# EAGLE design WifiAC-controller (EAGLE 7.4.0)
CNAME: Break-out board; CREVISION: V 2.0; DESIGNER: Mosab Wadea
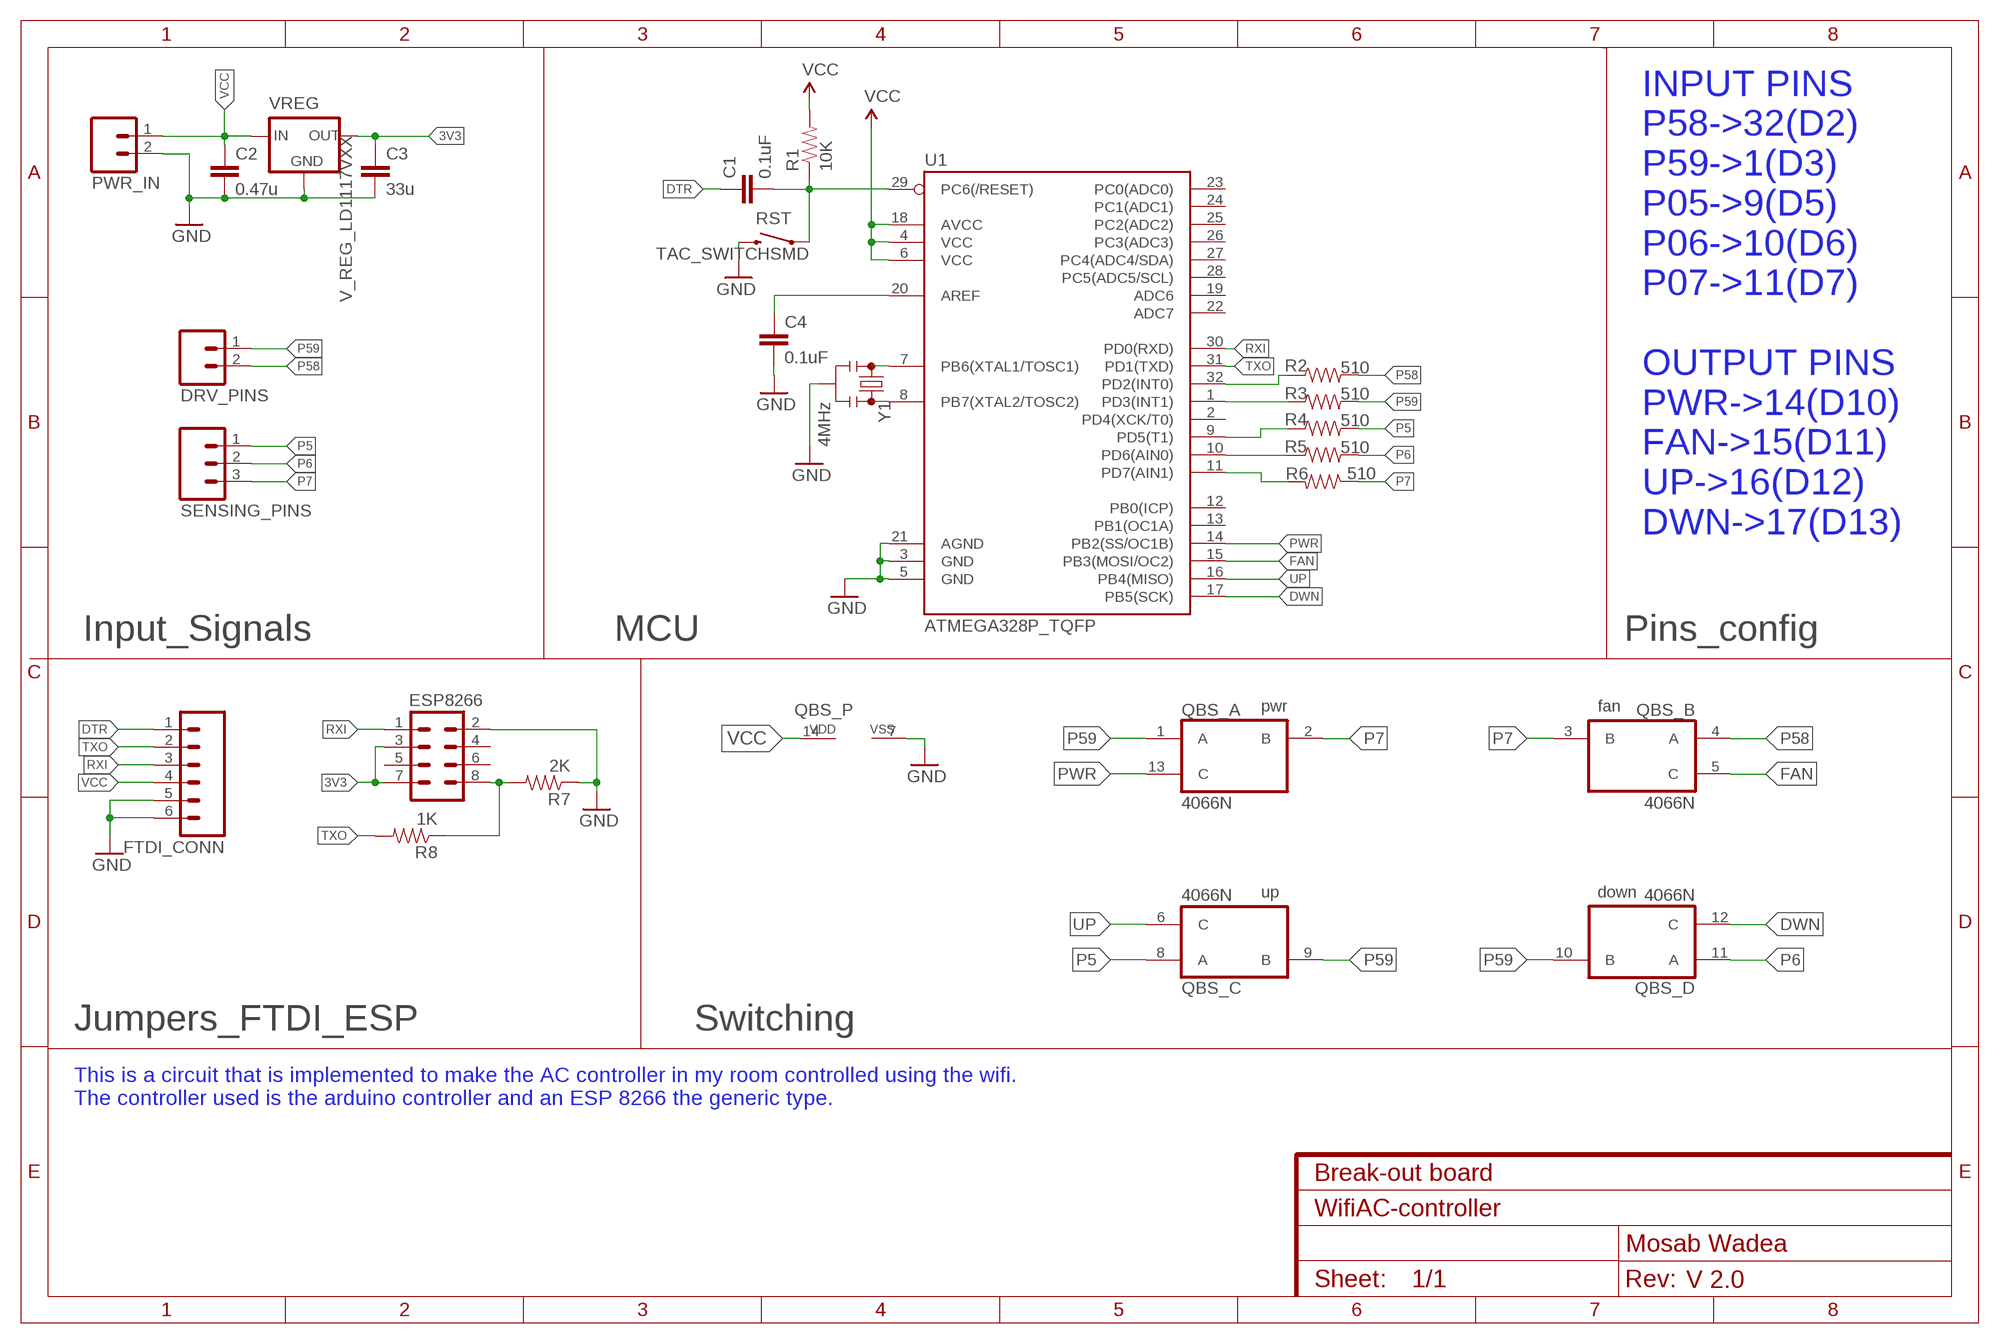
[diagram p0: schematic, sheet 1]

## Parts
C1  0.1uF  CAP0805  [0805]
C2  0.47u  CAP0805  [0805]
C3  33u  CAP0805  [0805]
C4  0.1uF  CAP0805  [0805]
DRV_PINS  M02POLAR  [MOLEX-1X2]
ESP8266  M04X2  [2X4]
FTDI_CONN  M06NO_SILK_FEMALE_PTH  [1X06_NO_SILK]
PWR_IN  M02POLAR  [MOLEX-1X2]
QBS_  4066N  [DIL14]
R1  10K  RESISTOR0805-RES  [0805]
R2  510  RESISTOR0805-RES  [0805]
R3  510  RESISTOR0805-RES  [0805]
R4  510  RESISTOR0805-RES  [0805]
R5  510  RESISTOR0805-RES  [0805]
R6  510  RESISTOR0805-RES  [0805]
R7  2K  RESISTOR0805-RES  [0805]
R8  1K  RESISTOR0805-RES  [0805]
RST  TAC_SWITCHSMD  SWITCH-MOMENTARY-2SMD-REDUNDANT  [TACTILE-SWITCH-SMD]
SENSING_PINS  M03POLAR  [MOLEX-1X3]
U1  ATMEGA328P_TQFP  [TQFP32-08]
VREG  V_REG_LD1117VXX  [78XXL]
Y1  4MHz  RESONATOR4MHZ  [RESONATOR-SMD_MED]

## Nets
3V3: C3.1 ESP8266.3 ESP8266.7 VREG.GND(OUT)
DTR: C1.1 FTDI_CONN.1
DWN: QBS_.12(D:C) U1.17(PB5(SCK))
FAN: QBS_.5(B:C) U1.15(PB3(MOSI/OC2))
GND: C2.2 C3.2 C4.2 ESP8266.2 FTDI_CONN.5 FTDI_CONN.6 PWR_IN.2 QBS_.7(P:VSS) R7.1 RST.3 RST.4 U1.3(GND) U1.5(GND) U1.21(AGND) VREG.IN(GND) Y1.2
N$1: C1.2 R1.1 RST.1 RST.2 U1.29(PC6(/RESET))
N$3: C4.1 U1.20(AREF)
N$4: U1.7(PB6(XTAL1/TOSC1)) Y1.1
N$5: U1.8(PB7(XTAL2/TOSC2)) Y1.3
N$6: R2.1 U1.32(PD2(INT0))
N$7: R3.1 U1.1(PD3(INT1))
N$8: R4.1 U1.9(PD5(T1))
N$9: R5.1 U1.10(PD6(AIN0))
N$10: R6.2 U1.11(PD7(AIN1))
N$14: ESP8266.8 R7.2 R8.1
P5: QBS_.8(C:A) R4.2 SENSING_PINS.1
P6: QBS_.11(D:A) R5.2 SENSING_PINS.2
P7: QBS_.2(A:B) QBS_.3(B:B) R6.1 SENSING_PINS.3
P58: DRV_PINS.2 QBS_.4(B:A) R2.2
P59: DRV_PINS.1 QBS_.1(A:A) QBS_.9(C:B) QBS_.10(D:B) R3.2
PWR: QBS_.13(A:C) U1.14(PB2(SS/OC1B))
RXI: ESP8266.1 FTDI_CONN.3 U1.30(PD0(RXD))
TXO: FTDI_CONN.2 R8.2 U1.31(PD1(TXD))
UP: QBS_.6(C:C) U1.16(PB4(MISO))
VCC: C2.1 FTDI_CONN.4 PWR_IN.1 QBS_.14(P:VDD) R1.2 U1.4(VCC) U1.6(VCC) U1.18(AVCC) VREG.OUT(IN)
Unconnected: ESP8266.4 ESP8266.5 ESP8266.6 U1.2(PD4(XCK/T0)) U1.12(PB0(ICP)) U1.13(PB1(OC1A)) U1.19(ADC6) U1.22(ADC7) U1.23(PC0(ADC0)) U1.24(PC1(ADC1)) U1.25(PC2(ADC2)) U1.26(PC3(ADC3)) U1.27(PC4(ADC4/SDA)) U1.28(PC5(ADC5/SCL))

## Notes on the sheet
- INPUT PINS
  P58->32(D2)
  P59->1(D3)
  P05->9(D5)
  P06->10(D6)
  P07->11(D7)
  
  OUTPUT PINS
  PWR->14(D10)
  FAN->15(D11)
  UP->16(D12)
  DWN->17(D13)
- Input_Signals | MCU | Pins_config
- pwr | fan
- up | down
- Jumpers_FTDI_ESP | Switching
- This is a circuit that is implemented to make the AC controller in my room controlled using the wifi.
  The controller used is the arduino controller and an ESP 8266 the generic type.

## Library data of the parts
C1-C4 = SparkFun-Passives:CAP: Capacitor Standard 0603 ceramic capacitor, and 0.1" leaded capacitor.
DRV_PINS PWR_IN = SparkFun-Connectors:M02: Standard 2-pin 0.1" header. Use with - straight break away headers ( PRT-00116) - right angle break away headers (PRT-00553) - swiss pins (PRT-00743) - machine pins (PRT-00117) - female headers (PRT-00115) Molex polarized connector foot print use with: PRT-08233 with associated crimp pins and housings. 2.54_SCREWTERM for use with PRT-10571. 3.5mm Screw Terminal footprints for PRT-08084 5mm Screw Terminal footprints for use with PRT-08432
ESP8266 = SparkFun-Connectors:M04X2: .1" header, two rows of four.
FTDI_CONN = SparkFun-Connectors:M06: Header 6 Standard 6-pin 0.1" header. Use with straight break away headers (SKU : PRT-00116), right angle break away headers (PRT-00553), swiss pins (PRT-00743), machine pins (PRT-00117), and female headers (PRT-00115). Molex polarized connector foot print use with SKU : PRT-08094 with associated crimp pins and housings. NOTES ON THE VARIANTS LOCK and LOCK_LONGPADS... This footprint was designed to help hold the alignment of a through-hole component (i.e. 6-pin header) while soldering it into place. You may notice that each hole has been shifted either up or down by 0.005 of an inch from it's more standard position (which is a perfectly straight line). This slight alteration caused the pins (the squares in the middle) to touch the edges of the holes. Because they are alternating, it causes a "brace" to hold the component in place. 0.005 has proven to be the perfect amount of "off-center" position when using our standard breakaway headers. Although looks a little odd when you look at the bare footprint, once you have a header in there, the alteration is very hard to notice. Also,if you push a header all the way into place, it is covered up entirely on the bottom side. This idea of altering the position of holes to aid alignment will be further integrated into the Sparkfun Library for other footprints. It can help hold any component with 3 or more connection pins.; PROD_ID: CONN-08437
QBS_ = 40xx:4066: Quad bilateral ANALOG SWITCH
R1-R8 = SparkFun-Passives:RESISTOR: Resistor Basic schematic elements and footprints for 0603, 1206, and PTH resistors.
RST = SparkFun-Electromechanical:SWITCH-MOMENTARY-2: Various NO switches- pushbuttons, reed, etc; PROD_ID: SWCH-08247
SENSING_PINS = SparkFun-Connectors:M03: Header 3 Standard 3-pin 0.1" header. Use with straight break away headers (SKU : PRT-00116), right angle break away headers (PRT-00553), swiss pins (PRT-00743), machine pins (PRT-00117), and female headers (PRT-00115). Molex polarized connector foot print use with SKU : PRT-08232 with associated crimp pins and housings.
U1 = SparkFun-DigitalIC:ATMEGA328P_TQFP; PROD_ID: IC-09069
VREG = SparkFun-PowerIC:V_REG_LD1117VXX: LD1117VXX voltage regulator. We carry the 3.3V version (COM-00526) in TO-220 package.
Y1 = SparkFun-FreqCtrl:RESONATOR: Resonator Small SMD resonator. Used, eg, on the Arduino Pro/ Pro Mini boards. 8MHz- XTAL-08895 16MHz- XTAL-08900; PROD_ID: XTAL-12492

## Board
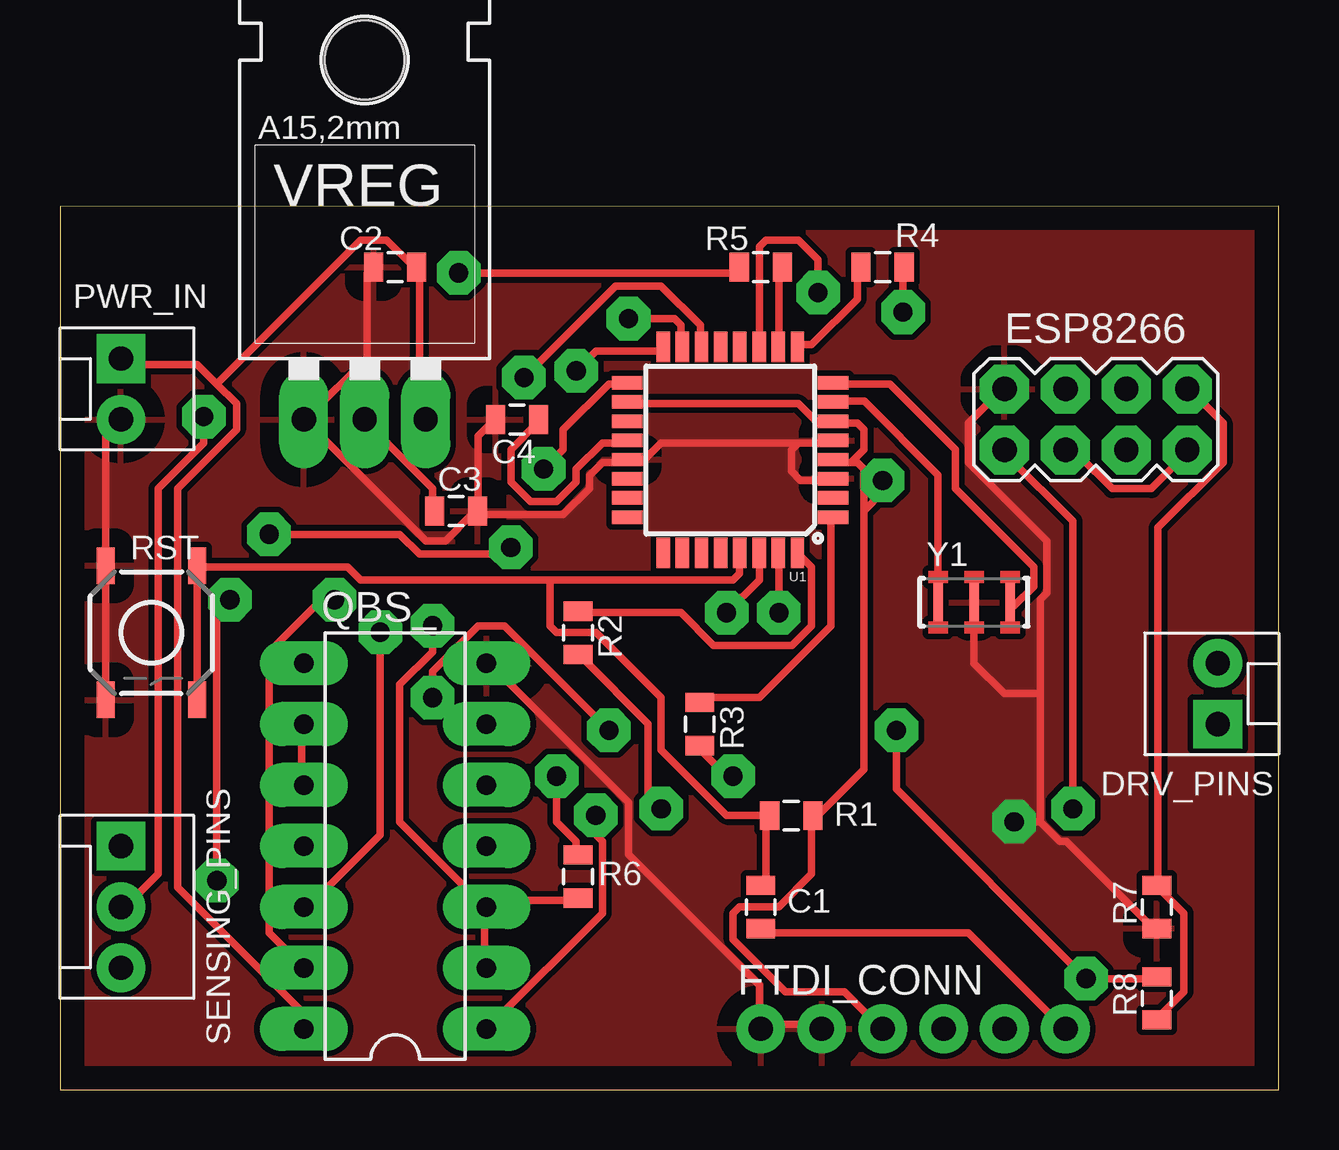
[diagram p1: board, top side]
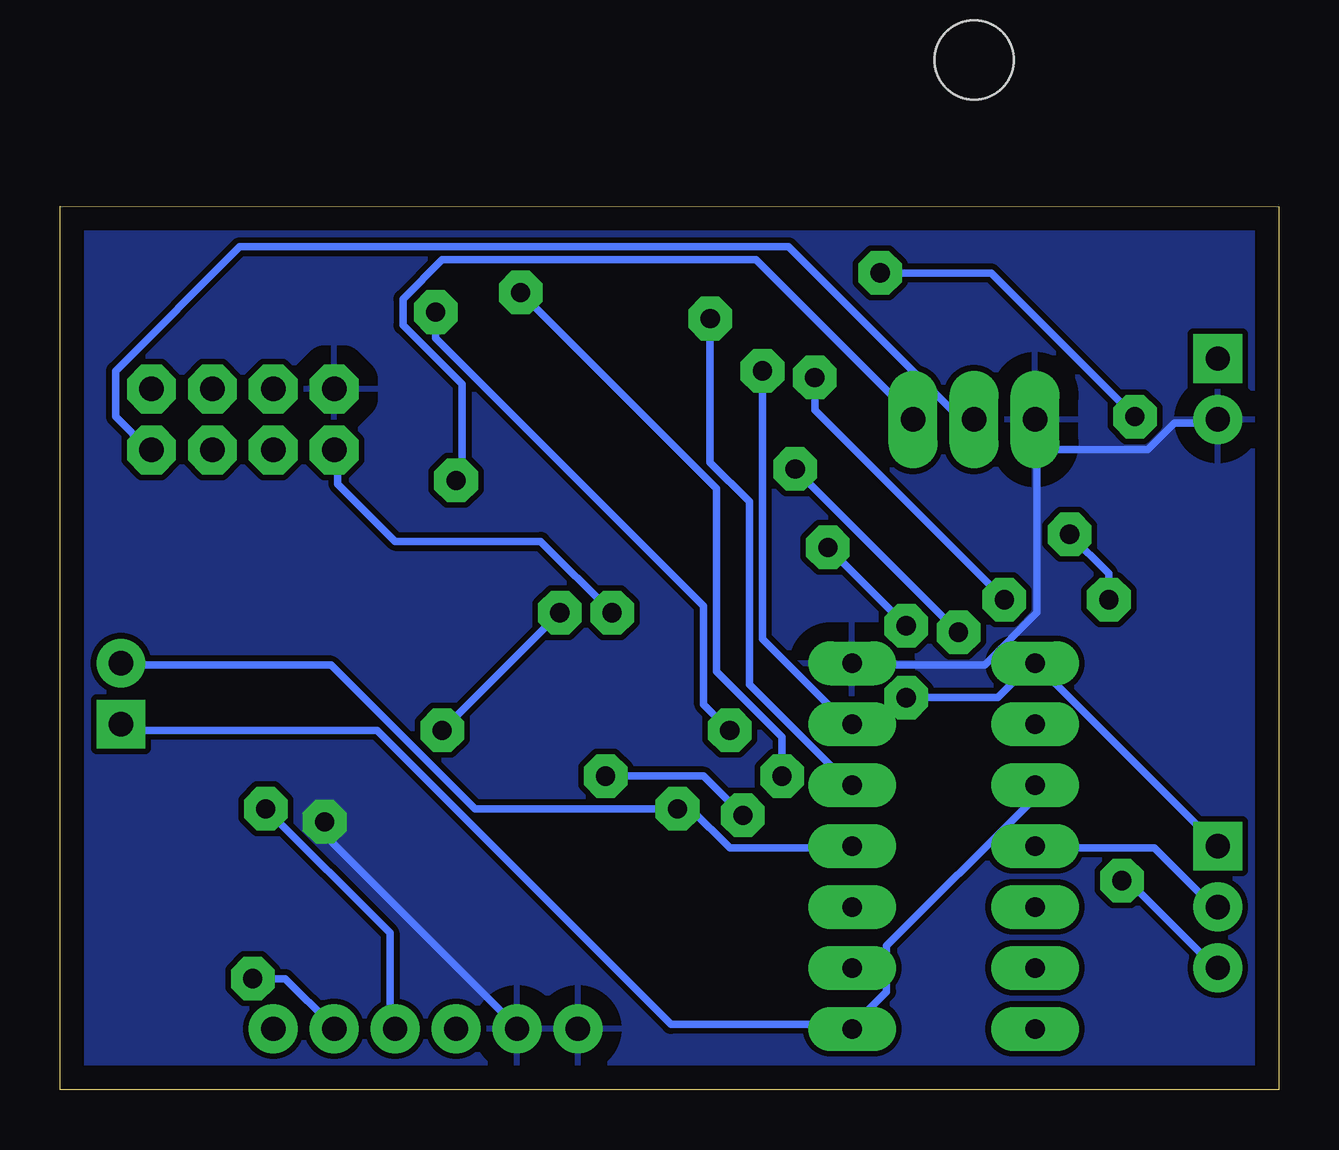
[diagram p2: board, bottom side, seen from below]

Size 50.8 x 36.83 mm. Coordinates in mm from the lower left corner, seen from the top.
Outline: 0,0 50.8,0 50.8,36.83 0,36.82 0,0
Copper layers (1*16): Top 0.035mm / dielectric 1.5mm / Bottom 0.035mm
Design rules "WifiAC-controller *": minimum track width 12mil, minimum drill 0.8mm, track to track 0.24mm, track to pad 0.24mm, pad to pad 0.24mm, via to via 0.24mm, smd to smd 0.24mm, copper to edge 1mm, drill to drill 0.4mm, minimum pad ring 10mil, minimum via ring 8mil, stop-mask expansion 4mil, vias tented up to drill 0mil, thermal gap 0.8mm
vRestrict: area 25.4,24.1 to 30.5,29.2

### Footprints (pad centres in the part's own frame; a part is rotated, then mirrored left to right if it is on the bottom)
0805 = smd 0.8 x 1.2: 1 -0.9,0; 2 0.9,0
MOLEX-1X2 = drill 1.016 pad 1.88 square: 1 0,0 | drill 1.016 pad 1.88: 2 2.54,0
2X4 = drill 1.016 pad 1.88 octagon: 1 -3.81,-1.27; 2 -3.81,1.27; 3 -1.27,-1.27; 4 -1.27,1.27; 5 1.27,-1.27; 6 1.27,1.27; 7 3.81,-1.27; 8 3.81,1.27
1X06_NO_SILK = drill 1.016 pad 1.88: 1 0,0; 2 2.54,0; 3 5.08,0; 4 7.62,0; 5 10.16,0; 6 12.7,0
DIL14 = drill 0.813 long: 1 -7.62,-3.81; 2 -5.08,-3.81; 3 -2.54,-3.81; 4 0,-3.81; 5 2.54,-3.81; 6 5.08,-3.81; 7 7.62,-3.81; 8 7.62,3.81; 9 5.08,3.81; 10 2.54,3.81; 11 0,3.81; 12 -2.54,3.81; 13 -5.08,3.81; 14 -7.62,3.81
TACTILE-SWITCH-SMD = smd 1.524 x 0.762: 1 -2.794,1.905; 2 2.794,1.905; 3 -2.794,-1.905; 4 2.794,-1.905
MOLEX-1X3 = drill 1.016 pad 1.88 square: 1 0,0 | drill 1.016 pad 1.88: 2 2.54,0; 3 5.08,0
TQFP32-08 = smd 1.27 x 0.559: 1 -4.293,2.8; 2 -4.293,2; 3 -4.293,1.2; 4 -4.293,0.4; 5 -4.293,-0.4; 6 -4.293,-1.2; 7 -4.293,-2; 8 -4.293,-2.8; 17 4.293,-2.8; 18 4.293,-2; 19 4.293,-1.2; 20 4.293,-0.4; 21 4.293,0.4; 22 4.293,1.2; 23 4.293,2; 24 4.293,2.8 | smd 0.559 x 1.27: 9 -2.8,-4.293; 10 -2,-4.293; 11 -1.2,-4.293; 12 -0.4,-4.293; 13 0.4,-4.293; 14 1.2,-4.293; 15 2,-4.293; 16 2.8,-4.293; 25 2.8,4.293; 26 2,4.293; 27 1.2,4.293; 28 0.4,4.293; 29 -0.4,4.293; 30 -1.2,4.293; 31 -2,4.293; 32 -2.8,4.293
78XXL = drill 1.016 long: GND 0,-3.81; IN -2.54,-3.81; OUT 2.54,-3.81 | hole 3.302: 0,11.176
RESONATOR-SMD_MED = smd 0.4 x 1.6: 1 -1.5,0; 2 0,0; 3 1.5,0

### Placement (x,y rotation side)
_REFERENCE_HOLE_  [_REFERENCE_HOLE_]  0,0 0 top
C1  29.21,7.62 90 top
C2  13.97,34.29 180 top
C3  16.51,24.13 0 top
C4  19.05,27.94 180 top
DRV_PINS  48.26,15.24 90 top
ESP8266  43.18,27.94 0 top
FTDI_CONN  41.91,2.54 180 top
PWR_IN  2.54,30.48 270 top
QBS_  13.97,10.16 90 top
R1  30.48,11.43 0 top
R2  21.59,19.05 270 top
R3  26.67,15.24 270 top
R4  34.29,34.29 0 top
R5  29.21,34.29 180 top
R6  21.59,8.89 90 top
R7  45.72,7.62 90 top
R8  45.72,3.81 90 top
RST  3.81,19.05 270 top
SENSING_PINS  2.54,10.16 270 top
U1  27.94,26.67 180 top
VREG  12.7,31.75 0 top
Y1  38.1,20.32 0 top

### Tracks (layer width: path | path; a pad name or v marks a point on that pad's centre or on a via)
3V3
  Top 0.305: C3.1 15.53,24.24 15.53,25.06 12.8,27.79 VREG.GND | ESP8266.3 41.95,26.42 42.49,26.42 43.86,25.06 45.49,25.06 46.85,26.42 ESP8266.7
  Bottom 0.305: VREG.GND 12.8,28.06 13.35,28.06 20.43,35.14 43.31,35.14 48.49,29.96 48.49,28.06 47.12,26.7 ESP8266.7
DTR
  Top 0.305: C1.1 29.42,6.54 37.86,6.54 41.68,2.72 FTDI_CONN.1
DWN  (via drill 0.8)
  Top 0.305: v20.16,25.88 20.98,26.7 20.98,27.51 22.88,29.42 23.43,29.42 U1.17 | v13.35,19.07 13.35,10.62 10.35,7.63 QBS_.12
  Bottom 0.305: v13.35,19.07 v20.16,25.88
FAN  (via drill 0.8)
  Top 0.305: v23.7,32.14 25.61,32.14 25.88,31.87 25.88,31.05 U1.15
  Bottom 0.305: v23.7,32.14 23.7,26.15 22.06,24.52 22.06,16.89 17.98,12.8 QBS_.5
GND  (via drill 0.8)
  Top 0.305: 40.86,11.17 41.68,10.35 41.95,10.35 45.49,6.81 R7.1 | 40.86,16.51 40.86,20.43 41.13,20.7 41.13,22.88 37.86,26.15 37.86,27.79 39.23,29.15 ESP8266.2 | 40.86,16.51 40.86,11.17 | C3.2 17.43,24.24 17.43,27.24 17.98,27.79 C4.2 | C3.2 17.43,23.97 20.98,23.97 22.06,25.06 22.06,25.61 22.61,26.15 23.43,26.15 U1.21 23.7,26.15 24.24,26.15 25.06,26.97 30.78,26.97 | U1.5 32.14,26.97 30.78,26.97 | RST.4 1.91,16.34 1.91,21.79 RST.3 1.91,22.06 1.91,27.24 2.45,27.79 PWR_IN.2 | FTDI_CONN.5 31.6,2.72 29.42,2.72 FTDI_CONN.6 29.15,2.72 29.15,4.36 23.7,9.81 23.7,11.99 17.98,17.71 QBS_.7 | C2.2 12.8,34.05 12.8,30.51 10.35,28.06 VREG.IN 10.35,27.79 15.25,22.88 16.07,22.88 17.16,23.97 C3.2 | v39.77,11.17 40.86,11.17 | Y1.2 38.1,17.78 39.37,16.51 40.86,16.51 | 30.78,26.97 30.48,26.67 30.48,25.78 30.86,25.4 32.16,25.4 U1.3
  Bottom 0.305: 10.08,26.7 10.08,27.79 VREG.IN | 10.08,26.7 10.08,19.89 12.26,17.71 17.71,17.71 QBS_.7 | 10.08,26.7 5.45,26.7 4.36,27.79 2.72,27.79 PWR_IN.2 | v39.77,11.17 39.77,10.62 31.87,2.72 FTDI_CONN.5
  pour Top (isolate 0.24): 0,0 0,36.83 50.8,36.83 50.8,0
  pour Bottom (isolate 0.24): 0,0 0,36.83 50.8,36.83 50.8,0
N$1
  Top 0.305: C1.2 29.42,8.72 29.42,11.17 R1.1 29.42,11.44 27.79,11.44 25.06,14.16 25.06,16.34 22.34,19.07 20.7,19.07 20.43,19.34 20.43,21.25 | 20.43,21.25 12.53,21.25 11.99,21.79 5.72,21.79 | 20.43,21.25 28.06,21.25 28.33,21.52 28.33,22.34 U1.29 | 5.72,21.79 5.72,16.34 RST.2 | 5.72,21.79 RST.1
N$3
  Top 0.305: C4.1 19.89,27.79 18.8,26.7 18.8,25.33 19.61,24.52 20.7,24.52 21.52,25.33 21.52,25.88 22.61,26.97 23.43,26.97 U1.20
N$4
  Top 0.305: Y1.1 36.6,25.63 33.53,28.7 32.27,28.7 U1.7
N$5
  Top 0.305: U1.8 32.42,29.42 34.59,29.42 37.32,26.7 37.32,25.06 40.59,21.79 40.59,20.98 39.77,20.16 Y1.3
N$6
  Top 0.305: R2.1 21.79,19.89 25.88,19.89 27.24,18.52 30.51,18.52 31.33,19.34 31.33,21.79 30.78,22.34 U1.32
N$7
  Top 0.305: R3.1 26.7,16.34 29.15,16.34 32.14,19.34 32.14,23.7 U1.1
N$8
  Top 0.305: R4.1 33.23,34.05 33.23,32.96 31.33,31.05 30.78,31.05 U1.9
N$9
  Top 0.305: R5.1 29.96,34.05 29.96,31.05 U1.10
N$10  (via drill 0.8)
  Top 0.305: v20.7,13.07 20.7,11.17 21.52,10.35 21.52,9.81 R6.2 | v31.6,33.23 31.6,34.59 30.78,35.41 29.42,35.41 29.15,35.14 29.15,31.05 U1.11
  Bottom 0.305: v20.7,13.07 20.7,14.71 23.43,17.43 23.43,25.06 v31.6,33.23
N$14
  Top 0.305: R8.1 45.76,3 46.85,4.09 46.85,7.36 45.76,8.44 R7.2 45.76,8.72 45.76,23.43 48.49,26.15 48.49,27.79 47.12,29.15 ESP8266.8
P5  (via drill 0.8)
  Top 0.305: v35.14,32.42 35.14,34.05 R4.2 | v22.88,14.98 18.52,19.34 17.43,19.34 15.53,17.43 v15.53,16.34
  Bottom 0.305: v35.14,32.42 35.14,31.33 23.97,20.16 23.97,16.07 v22.88,14.98 | v15.53,16.34 11.71,16.34 10.35,17.71 QBS_.8 10.08,17.71 2.72,10.35 SENSING_PINS.1
P6  (via drill 0.8)
  Top 0.305: v16.62,34.05 28.06,34.05 R5.2 | v5.99,28.06 5.99,26.97 4.09,25.06 4.09,8.99 2.72,7.63 SENSING_PINS.2
  Bottom 0.305: v16.62,34.05 11.99,34.05 v5.99,28.06 | QBS_.11 10.08,10.08 5.18,10.08 2.72,7.63 SENSING_PINS.2
P7  (via drill 0.8)
  Top 0.305: R6.1 21.52,7.9 18.25,7.9 17.98,7.63 QBS_.3 | QBS_.2 17.71,5.18 17.71,7.36 QBS_.3 | v6.54,8.72 6.54,19.89 v7.08,20.43 | v8.72,23.15 14.16,23.15 14.98,22.34 18.52,22.34 v18.8,22.61 | v15.53,19.34 15.53,18.25 14.16,16.89 14.16,11.17 17.71,7.63 QBS_.3
  Bottom 0.305: v6.54,8.72 6.26,8.72 2.72,5.18 SENSING_PINS.3 | v7.08,20.43 7.08,21.52 v8.72,23.15 | v15.53,19.34 v18.8,22.61
P58  (via drill 0.8)
  Top 0.305: v25.06,11.71 24.52,12.26 24.52,15.25 21.79,17.98 R2.2
  Bottom 0.305: QBS_.4 17.98,10.08 22.88,10.08 24.52,11.71 v25.06,11.71 33.51,11.71 39.5,17.71 48.22,17.71 DRV_PINS.2
P59  (via drill 0.8)
  Top 0.305: QBS_.10 10.08,12.8 10.08,14.98 QBS_.9 | v28.06,13.07 27.79,13.07 26.7,14.16 R3.2 | v22.34,11.44 22.34,10.62 22.61,10.35 22.61,7.36 17.98,2.72 QBS_.1
  Bottom 0.305: v28.06,13.07 23.97,13.07 v22.34,11.44 | DRV_PINS.1 48.22,14.98 37.59,14.98 25.33,2.72 17.98,2.72 QBS_.1 17.71,2.72 16.34,4.09 16.34,5.99 10.35,11.99 10.35,12.53 QBS_.10
PWR  (via drill 0.8)
  Top 0.305: v19.34,29.69 23.15,33.51 25.06,33.51 26.7,31.87 26.7,31.05 U1.14 | v11.44,20.43 10.9,20.43 8.72,18.25 8.72,6.54 10.08,5.18 QBS_.13
  Bottom 0.305: v19.34,29.69 19.34,28.33 v11.44,20.43
RXI  (via drill 0.8)
  Top 0.305: v27.79,19.89 29.15,21.25 29.15,22.34 U1.30 | v42.22,11.71 42.22,23.7 39.5,26.42 ESP8266.1
  Bottom 0.305: ESP8266.1 39.23,26.42 39.23,25.26 36.83,22.86 30.76,22.86 v27.79,19.89 | v42.22,11.71 37.05,6.54 37.05,2.72 FTDI_CONN.3
TXO  (via drill 0.8)
  Top 0.305: R8.2 45.49,4.63 v42.77,4.63 34.87,12.53 v34.87,14.98 | v29.96,19.89 29.96,22.34 U1.31
  Bottom 0.305: v42.77,4.63 41.41,4.63 39.5,2.72 FTDI_CONN.2 | v34.87,14.98 v29.96,19.89
UP  (via drill 0.8)
  Top 0.305: v21.52,29.96 22.34,30.78 25.06,30.78 U1.16
  Bottom 0.305: v21.52,29.96 21.52,18.8 17.98,15.25 QBS_.6
VCC  (via drill 0.8)
  Top 0.305: 32.96,26.15 32.42,26.15 U1.4 | 32.96,26.15 33.51,26.7 33.51,27.51 33.23,27.79 32.42,27.79 U1.6 32.14,27.79 31.6,27.79 30.78,28.6 23.7,28.6 U1.18 | FTDI_CONN.4 34.05,2.72 32.69,4.09 30.24,4.09 28.06,6.26 28.06,7.36 28.33,7.63 29.96,7.63 31.33,8.99 31.33,11.17 R1.2 31.6,11.44 33.51,13.35 33.51,24.13 | 32.96,26.15 33.23,26.15 33.51,25.88 33.51,24.13 | VREG.OUT 14.98,28.06 14.98,34.05 C2.1 14.71,34.32 13.62,35.41 12.53,35.41 6.54,29.42 | 6.54,29.42 5.72,30.24 2.72,30.24 PWR_IN.1 | 6.54,29.42 7.36,28.6 7.36,27.51 4.9,25.06 4.9,8.44 10.08,3.27 10.08,2.72 QBS_.14 | v34.29,25.4 34.29,24.91 33.51,24.13
  Bottom 0.305: VREG.OUT 15.25,28.06 21.79,34.59 34.87,34.59 36.5,32.96 36.5,31.87 34.05,29.42 34.05,25.64 v34.29,25.4